# Altium schematic sheet USB.SchDoc: USB
size Letter; DocumentNumber: 3; SheetNumber: 3; SheetTotal: 11
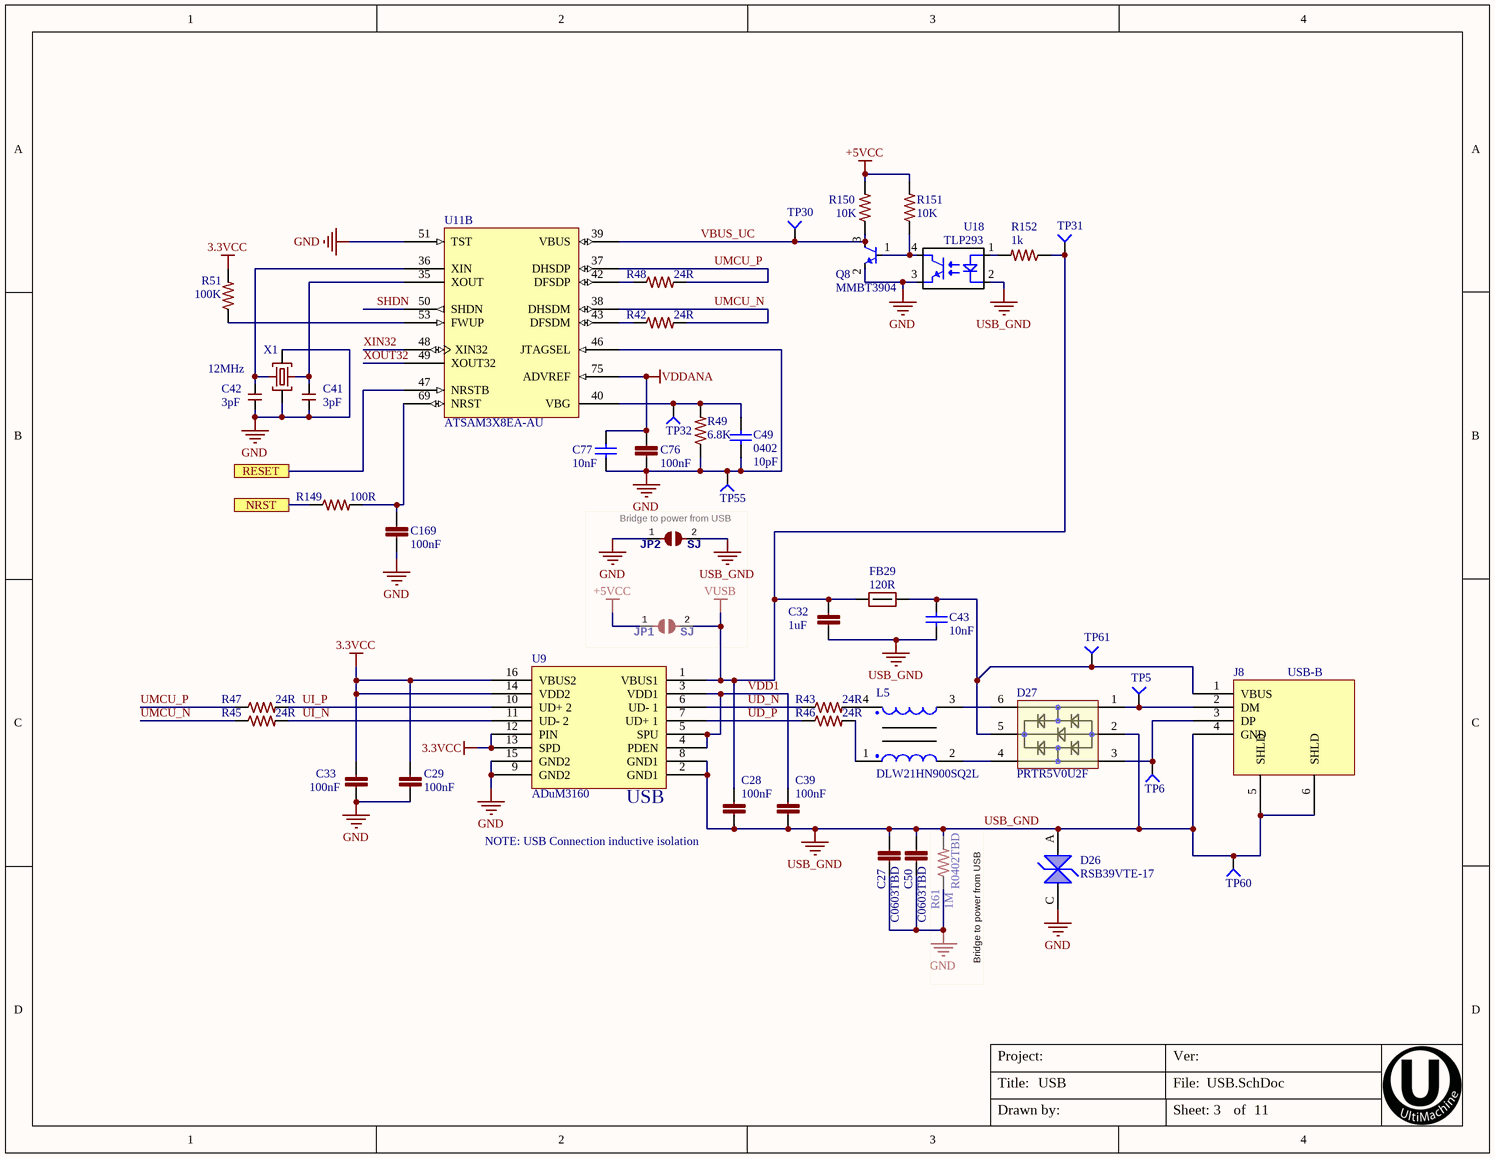
[diagram p0: USB.SchDoc]

## Parts
C27  C0603TBD  [C0603]
C28  100nF  [C0402]
C29  100nF  [C0402]
C32  1uF  [C0402]
C33  100nF  [C0402]
C39  100nF  [C0402]
C41  3pF  [C0603]
C42  3pF  [C0603]
C43  10nF  [C0402]
C49  0402  value 10pF  [C0402]
C50  C0603TBD  [C0603]
C76  100nF  [C0402]
C77  10nF  [C0402]
C169  100nF  [C0402]
D26  RSB39VTE-17  [SOD323-R]
D27  PRTR5V0U2F  [SOT886]
FB29  120R  [FB0603]
J8  USB-B  [PN61729]
JP1  SJ  [SJ]  (no BOM)
JP2  SJ  [SJ]  (no BOM)
L5  DLW21HN900SQ2L  [DLW21HN900SQ2L]
Q8  MMBT3904  [SOT523 SMALL]
R42  24R  [R0402]
R43  24R  [R0402]
R45  24R  [R0402]
R46  24R  [R0402]
R47  24R  [R0402]
R48  24R  [R0402]
R49  6.8K  [R0402]
R51  100K  [R0402]
R61  R0402TBD  value 1M  [R0402TBD]
R149  100R  [R0402]
R150  10K  [R0402]
R151  10K  [R0402]
R152  1k  [R0402]
TP5  TP4  [TP-2]  (value not drawn)  (no BOM)
TP6  TP4  [TP-2]  (value not drawn)  (no BOM)
TP30  TP4  [TP-2]  (value not drawn)  (no BOM)
TP31  TP4  [TP-2]  (value not drawn)  (no BOM)
TP32  TP4  [TP-2]  (value not drawn)  (no BOM)
TP55  TP4  [TP-2]  (value not drawn)  (no BOM)
TP60  TP4  [TP-2]  (value not drawn)  (no BOM)
TP61  TP4  [TP-2]  (value not drawn)  (no BOM)
U9  ADuM3160  [ADuM4160]
U11  ATSAM3X8EA-AU  [LQFP144_N]  (part B of 3)
U18  TLP293  [SO-4]
X1  12MHz  [CRYS320500]

## Blocks framed on the sheet
Bridge to power from USB: JP1 JP2

## Ports
NRST, RESET

## Nets
3.3VCC: C29.1 C33.1 R51.2 U9.12(PIN) U9.13(SPD) U9.14(VDD2) U9.16(VBUS2)
+5VCC: JP1.1 R150.2 R151.2
GND: C27.2 C29.2 C33.2 C41.1 C42.1 C49.2 C50.2 C76.2 C77.2 C169.2 D26.C JP2.1 Q8.2(E) R49.1 R61.1 TP55.1 U9.9(GND2) U9.15(GND2) U11.46(JTAGSEL) U11.51(TST) U18.3(E) X1.2(GND) X1.4(GND)
USB_GND: C27.1 C28.2 C32.2 C39.2 C43.1 C50.1 D26.A D27.2 J8.4(GND) J8.5(SHLD) J8.6(SHLD) JP2.2 R61.2 TP60.1 U9.2(GND1) U9.8(GND1) U18.2(K)
VDDANA: C76.1 C77.1 U11.75(ADVREF)
VUSB: C28.1 C32.1 FB29.1 JP1.2 R152.1 TP31.1 U9.1(VBUS1)
NRST: R149.1 ; port NRST
RESET: U11.47(NRSTB) ; port RESET
SHDN: U11.50(SHDN)
UD_N: R43.1 U9.6(UD-_1)
UD_P: R46.1 U9.7(UD+_1)
UI_N: R45.2 U9.11(UD-_2)
UI_P: R47.2 U9.10(UD+_2)
UMCU_N: R42.2 R45.1 U11.38(DHSDM)
UMCU_P: R47.1 R48.2 U11.37(DHSDP)
VBUS_UC: Q8.3(C) R150.1 TP30.1 U11.39(VBUS)
VDD1: C39.1 U9.3(VDD1) U9.4(PDEN) U9.5(SPU)
XIN32: U11.48(XIN32)
XOUT32: U11.49(XOUT32)
NetC41_2: C41.2 U11.35(XOUT) X1.3(C2)
NetC42_2: C42.2 U11.36(XIN) X1.1(C1)
NetC43_2: C43.2 D27.5 FB29.2 J8.1(VBUS) TP61.1
NetC49_1: C49.1 R49.2 TP32.1 U11.40(VBG)
NetC169_1: C169.1 R149.2 U11.69(NRST)
NetD27_1: D27.1 J8.2(DM) TP5.1
NetD27_3: D27.3 J8.3(DP) TP6.1
NetD27_4: D27.4 L5.2
NetD27_6: D27.6 L5.3
NetL5_1: L5.1 R46.2
NetL5_4: L5.4 R43.2
NetQ8_1: Q8.1(B) R151.1 U18.4(C)
NetR42_1: R42.1 U11.43(DFSDM)
NetR48_1: R48.1 U11.42(DFSDP)
NetR51_1: R51.1 U11.53(FWUP)
NetR152_2: R152.2 U18.1(A)

## Notes on the sheet
- (near U9) USB
- (near C28) NOTE: USB Connection inductive isolation
- (near R61) Bridge to power from USB
- Title:
- Project:
- File:
- Ver:
- Drawn by:
- Sheet:
- of

## Library data of the parts
C27 C50 = C0603TBD: Capacitor Non Polarized; MANUFACTURER #: DNI-C0603TBD; VALUE: C0603TBD; PART: DNI-C0603TBD; DNI: DNI
C28 C29 C33 C39 C76 C169 = GRM155R71C104KA88D: CAP CER 0402 100nF 16V 10% X7R; MANUFACTURER: Murata; PART DESCRIPTION: 0.10µF ±10% 16V Ceramic Capacitor X7R 0402 (1005 Metric); EE_SPEC: 100nF 16V X7R 0402; VALUE: 100nF; MANUFACTURER #: GRM155R71C104KA88D; DISTRIBUTOR #: 490-3261-2-ND; DISTRIBUTOR: Digi-Key Electronics; PART: GRM155R71C104KA88D; TOLERANCE: 10%
C32 = GRM155R60J105KE19D: CAP CER 0402 1uF 6.3V 10% X5R; MANUFACTURER: Murata; PART DESCRIPTION: 1µF ±10% 6.3V Ceramic Capacitor X5R 0402 (1005 Metric); EE_SPEC: 1uF 6.3V X5R 0402; VALUE: 1uF; MANUFACTURER #: GRM155R60J105KE19D; DISTRIBUTOR #: 490-1320-2-ND; DISTRIBUTOR: Digi-Key Electronics; PART: GRM155R60J105KE19D; TOLERANCE: 10%
C41 C42 = 3pF 0603 50V NP0: CAP CER 3PF 50V NP0 0603; MANUFACTURER: Samsung; MANUFACTURER #: CL10C030BB8NNNC; PART DESCRIPTION: 3pF ±0.1pF 50V Ceramic Capacitor C0G, NP0 0603 (1608 Metric); TOLERANCE: +/- 0.1pF; DISTRIBUTOR #: 1276-2125-2-ND; DISTRIBUTOR: Digi-Key Electronics; PART: CL10C030BB8NNNC; EE_SPEC: 50V; VALUE: 3pF
C43 C77 = GRM155R71H103JA88D: CAP CER 10nF 50V X7R 0402; PART DESCRIPTION: 10000pF ±5% 50V Ceramic Capacitor X7R 0402 (1005 Metric); MANUFACTURER: Murata; TOLERANCE: 5%; EE_SPEC: 50V; VALUE: 10nF; MANUFACTURER #: GRM155R71H103JA88D; DISTRIBUTOR #: 490-7763-1-ND; DISTRIBUTOR: Digi-Key Electronics; PART: GRM155R71H103JA88D
C49 = CL05C100JB5NNNC: CAP CER 10PF 50V 5% NP0 0402; PART DESCRIPTION: 10pF ±5% 50V Ceramic Capacitor C0G, NP0 0402 (1005 Metric); MANUFACTURER: Samsung; TOLERANCE: 5%; EE_SPEC: 50V; MANUFACTURER #: CL05C100JB5NNNC; DISTRIBUTOR #: 1276-1139-2-ND; DISTRIBUTOR: Digi-Key Electronics; PART: CL05C100JB5NNNC
D26 = RSB39VTE-17: DIODE TVS; MANUFACTURER: Rohm; PART DESCRIPTION: TVS DIODE 30VWM SOD323; TOLERANCE: -NA-; VALUE: 30V; EE_SPEC: 30Vso 30pF; MANUFACTURER #: RSB39VTE-17; DISTRIBUTOR #: RSB39VTE-17TR-ND; DISTRIBUTOR: Digi-Key Electronics; PART: RSB39VTE-17
D27 = PRTR5V0U2F: Rail-to-rail ESD protection devices; MANUFACTURER #: PRTR5V0U2F,115; MANUFACTURER: NXP; PART DESCRIPTION: TVS DIODE 5.5VWM SOT886; TOLERANCE: -NA-; VALUE: 5.5V; EE_SPEC: 5.5Vso 1pF; DISTRIBUTOR #: 568-4677-2-ND; DISTRIBUTOR: Digi-Key Electronics; PART: PRTR5V0U2F,115
FB29 = FERRITE 120R 3A 0603: FERRITE BEAD 120 OHM 0603 1LN; MANUFACTURER: Samsung; MANUFACTURER #: CIS10P121AC; MANUFACTURER2#: 490-5254-2-ND; VALUE: 120Rfb; TOLERANCE: -NA-; EE_SPEC: 3A; DISTRIBUTOR #: 1276-6351-2-ND; DISTRIBUTOR: Digi-Key Electronics; PART: CIS10P121AC; PART DESCRIPTION: FERRITE BEAD 120 OHM 0603 1LN
J8 = USB-B: MANUFACTURER #: 61729-0010BLF; MANUFACTURER: Amphenol FCI; PART DESCRIPTION: USB - B USB 2.0 Receptacle Connector 4 Position Through Hole, Right Angle; TOLERANCE: -NA-; VALUE: USB B; DISTRIBUTOR #: 609-1039-ND; DISTRIBUTOR: Digi-Key Electronics; PART: 61729-0010BLF; EE_SPEC: -NA-
JP1 JP2 = SJ: SMD solder jumper; MANUFACTURER #: NOTAPART-Solder Bridge; PART: NOTAPART-Solder Bridge
L5 = DLW21HN900SQ2L: Common Mode Chokes Dual 90Ohm 100MHz 330mA 350mOhm DCR SMD; MANUFACTURER: Murata; PART DESCRIPTION: 2 Line Common Mode Choke Surface Mount 90 Ohm @ 100MHz 330mA DCR 350 mOhm; TOLERANCE: -NA-; VALUE: 90R; EE_SPEC: 50V 330mA 0.33Ohm; MANUFACTURER #: DLW21HN900SQ2L; DISTRIBUTOR #: 490-1064-2-ND; DISTRIBUTOR: Digi-Key Electronics; PART: DLW21HN900SQ2L
Q8 = MMBT3904_SOT523: TRANS NPN 60V 0.2A SOT523; MANUFACTURER #: MMBT3904T-7-F; MANUFACTURER: Diodes Incorporated; PART DESCRIPTION: Bipolar (BJT) Transistor NPN 40V 200mA 300MHz 150mW Surface Mount SOT-523; TOLERANCE: -NA-; EE_SPEC: 40V 0.2A; DISTRIBUTOR #: MMBT3904T-FDITR-ND; DISTRIBUTOR: Digi-Key Electronics; PART: MMBT3904T-7-F; VALUE: NPN
R42 R43 R45-R48 = CRCW040224R0FKED: Res Thick Film 0402 24 Ohm 1% 0.063W; MANUFACTURER: Yageo; MANUFACTURER #: RC0402FR-0724RL; PART DESCRIPTION: 24 Ohm ±1% 0.063W, 1/16W Chip Resistor 0402 (1005 Metric) Moisture Resistant Thick Film; EE_SPEC: 1/16W; VALUE: 24R; DISTRIBUTOR #: YAG3073TR-ND; DISTRIBUTOR: Digi-Key Electronics; PART: RC0402FR-0724RL; TOLERANCE: 1%
R49 = CRCW04026K80FKED: RES SMD 6.8K OHM 1% 1/16W 0402; MANUFACTURER: Vishay Dale; PART DESCRIPTION: 6.8k Ohm ±1% 0.063W, 1/16W Chip Resistor 0402 (1005 Metric) Automotive AEC-Q200 Thick Film; VALUE: 6.8K; MANUFACTURER #: CRCW04026K80FKED; DISTRIBUTOR #: 541-6.80KLTR-ND; DISTRIBUTOR: Digi-Key Electronics; PART: CRCW04026K80FKED; TOLERANCE: 1%; EE_SPEC: 1/16W
R51 = RC1005F104CS: RES SMD 100K OHM 1% 1/16W 0402; MANUFACTURER: Samsung; PART DESCRIPTION: 100k Ohm ±1% 0.063W, 1/16W Chip Resistor 0402 (1005 Metric) Moisture Resistant Thick Film; VALUE: 100K; MANUFACTURER #: RC1005F104CS; DISTRIBUTOR #: 1276-3432-1-ND; DISTRIBUTOR: Digi-Key Electronics; PART: RC1005F104CS; TOLERANCE: 1%; EE_SPEC: 1/16W
R61 = ERJ2GEJ105X: RES 0402 1M 100mW 5%; MANUFACTURER: Panasonic; PART DESCRIPTION: 1M Ohm ±5% 0.1W, 1/10W Chip Resistor 0402 (1005 Metric) Automotive AEC-Q200 Thick Film; EE_SPEC: 1/10W; MANUFACTURER #: ERJ2GEJ105X; DISTRIBUTOR #: P1.0MJTR-ND; DISTRIBUTOR: Digi-Key Electronics; PART: ERJ2GEJ105X; TOLERANCE: 5%; DNI: DNI
R149 = RES 100R 0402 1%: RES SMD 100 OHM 1% 1/16W 0402; MANUFACTURER: Yageo; MANUFACTURER #: RC0402FR-07100RL; PART DESCRIPTION: 100 Ohm ±1% 0.063W, 1/16W Chip Resistor 0402 (1005 Metric) Moisture Resistant Thick Film; VALUE: 100R; DISTRIBUTOR #: 311-100LRTR-ND; DISTRIBUTOR: Digi-Key Electronics; PART: RC0402FR-07100RL; TOLERANCE: 1%; EE_SPEC: 1/16W
R150 R151 = RC0402FR-0710KP: RES SMD 10K OHM 1% 1/16W 0402; MANUFACTURER: Yageo; PART DESCRIPTION: 10k Ohm ±1% 0.063W, 1/16W Chip Resistor 0402 (1005 Metric) Moisture Resistant Thick Film; VALUE: 10K; MANUFACTURER #: RC0402FR-0710KP; DISTRIBUTOR #: YAG1249TR-ND; DISTRIBUTOR: Digi-Key Electronics; PART: RC0402FR-0710KP; TOLERANCE: 1%; EE_SPEC: 1/16W
R152 = RK73H1ETTP1001F: RES 0402 1k 63mW 1%; MANUFACTURER: Yageo; MANUFACTURER #: RC0402FR-071KL; PART DESCRIPTION: 1k Ohm ±1% 0.063W, 1/16W Chip Resistor 0402 (1005 Metric) Moisture Resistant Thick Film; EE_SPEC: 1/16W; VALUE: 1k; DISTRIBUTOR #: 311-1.00KLRTR-ND; DISTRIBUTOR: Digi-Key Electronics; PART: RC0402FR-071KL; TOLERANCE: 1%
TP5 TP6 TP30-TP32 TP55 TP60 TP61 = Socket: MANUFACTURER #: NOTAPART-Testpoint; PART: NOTAPART-Testpoint
U9 = ADuM4160: USB Opto Isolator; MANUFACTURER #: ADUM3160BRWZ-RL; MANUFACTURER: Analog Devices; PART DESCRIPTION: USB Digital Isolator 2500Vrms 2 Channel 12Mbps 25kV/µs CMTI 16-SOIC (0.295", 7.50mm Width); TOLERANCE: -NA-; VALUE: USB ISO; EE_SPEC: 2500V ISO; DISTRIBUTOR #: ADUM3160BRWZ-RLTR-ND; DISTRIBUTOR: Digi-Key Electronics; PART: ADUM3160BRWZ-RL
U11 = ATML-ATSAM3X-LQFP-144: Atmel; PART DESCRIPTION: ARM® Cortex®-M3 SAM3X Microcontroller IC 32-Bit 84MHz 512KB (512K x 8) FLASH 144-LQFP (20x20); TOLERANCE: -NA-; VALUE: -NA-; EE_SPEC: 3.3V; MANUFACTURER #: ATSAM3X8EA-AU; MANUFACTURER: Atmel; DISTRIBUTOR #: ATSAM3X8EA-AU-ND; DISTRIBUTOR: Digi-Key Electronics; PART: ATSAM3X8EA-AU
U18 = OPTO SO-4 OPNDRN OUT: Optoisolator Transistor Output 3750Vrms 1 Channel 4-SO; MANUFACTURER #: TLP293(TPL,E; MANUFACTURER: TOSHIBA; TOLERANCE: -NA-; VALUE: -NA-; EE_SPEC: 3.75kV Isolation; DISTRIBUTOR #: TLP293(TPLETR-ND; DISTRIBUTOR: Digi-Key Electronics; PART: TLP293(TPL,E; PART DESCRIPTION: Optoisolator Transistor Output 3750Vrms 1 Channel 4-SO
X1 = 405C35B12M00000: Crystal 12MHz ±30ppm (Tol) ±50ppm (Stability) 13pF FUND 50Ohm; MANUFACTURER: CTS; PART DESCRIPTION: 12MHz ±30ppm Crystal 13pF 60 Ohm -20°C ~ 70°C Surface Mount 4-SMD, No Lead (DFN, LCC); TOLERANCE: +/- 30ppm; EE_SPEC: -NA-; MANUFACTURER #: 405C35B12M00000; DISTRIBUTOR #: CTX639TR-ND; DISTRIBUTOR: Digi-Key Electronics; PART: 405C35B12M00000; VALUE: 12MHz